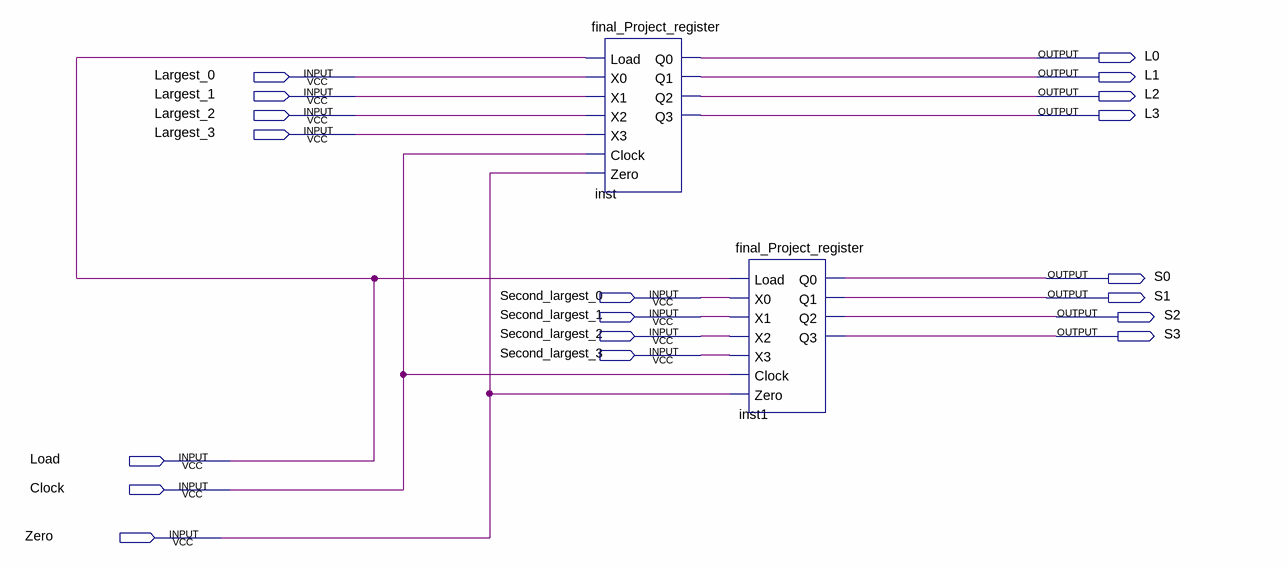
[diagram p0: schematic sheet]
// Quartus schematic final_project_two_number_Register.bdf as structural Verilog: 2 symbols, 19 pins
module final_project_two_number_Register (
  input  Largest_0,
  input  Largest_1,
  input  Largest_2,
  input  Largest_3,
  input  Second_largest_0,
  input  Second_largest_1,
  input  Second_largest_2,
  input  Second_largest_3,
  input  Load,
  input  Clock,
  input  Zero,
  output L0,
  output L1,
  output L2,
  output L3,
  output S0,
  output S1,
  output S2,
  output S3
);

  final_Project_register inst (
    .Load(Load), .X0(Largest_0), .X1(Largest_1), .X2(Largest_2), .X3(Largest_3), .Clock(Clock), .Zero(Zero),
    .Q0(L0), .Q1(L1), .Q2(L2), .Q3(L3));
  final_Project_register inst1 (
    .Load(Load), .X0(Second_largest_0), .X1(Second_largest_1), .X2(Second_largest_2), .X3(Second_largest_3),
    .Clock(Clock), .Zero(Zero), .Q0(S0), .Q1(S1), .Q2(S2), .Q3(S3));
endmodule
